# EAGLE design SingleLight (EAGLE 7.3.0)
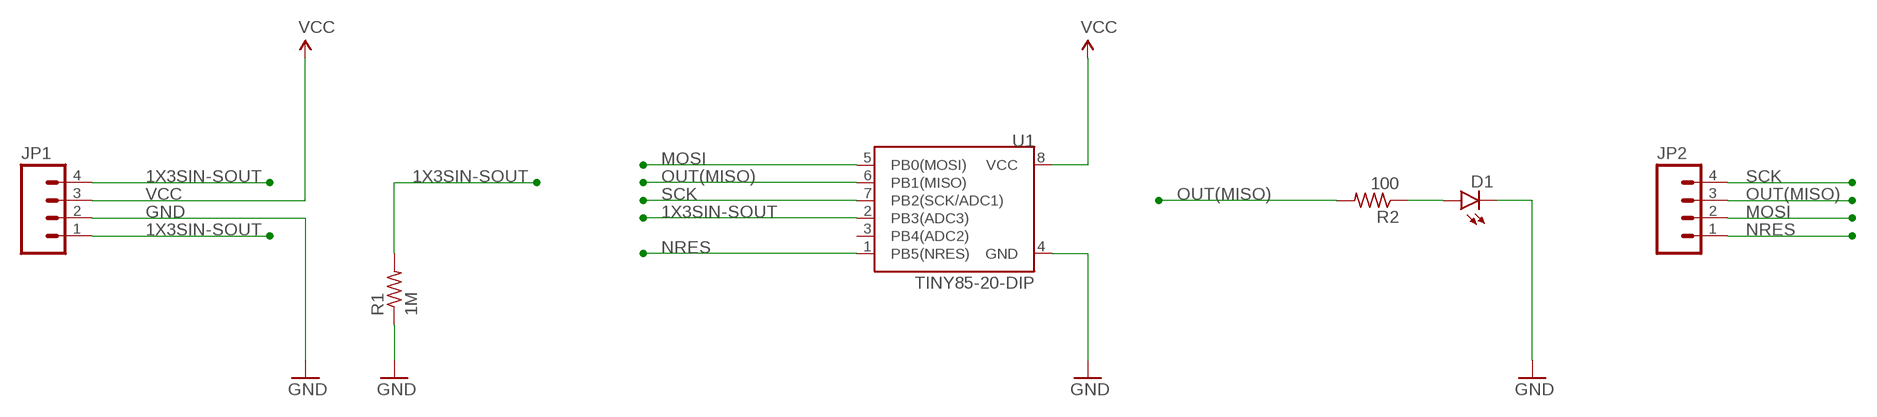
[diagram p0: schematic, sheet 1]

## Parts
D1  LED5MM  [LED5MM]
JP1  M04PTH  [1X04]
JP2  M04PTH  [1X04]
R1  1M  R-US_R0603  [R0603]
R2  100  R-US_R0603  [R0603]
U1  TINY85-20-DIP  ATTINY45TINY85-20-DIP  [DIP08]

## Nets
1X3SIN-SOUT: JP1.1 JP1.4 R1.2 U1.2(PB3(ADC3))
GND: D1.K(C) JP1.2 R1.1 U1.4(GND)
MOSI: JP2.2 U1.5(PB0(MOSI))
N$1: D1.A R2.1
NRES: JP2.1 U1.1(PB5(NRES))
OUT(MISO): JP2.3 R2.2 U1.6(PB1(MISO))
SCK: JP2.4 U1.7(PB2(SCK/ADC1))
VCC: JP1.3 U1.8(VCC)
Unconnected: U1.3(PB4(ADC2))

## Library data of the parts
D1 = SparkFun-LED:LED: LEDs Standard schematic elements and footprints for 5mm, 3mm, 1206, and 0603 sized LEDs. 5mm - Spark Fun Electronics SKU : COM-00529 (and others)
JP1 JP2 = SparkFun-Connectors:M04: Header 4 Standard 4-pin 0.1" header. Use with straight break away headers (SKU : PRT-00116), right angle break away headers (PRT-00553), swiss pins (PRT-00743), machine pins (PRT-00117), and female headers (PRT-00115). Molex polarized connector foot print use with SKU : PRT-08231 with associated crimp pins and housings. 1MM SMD Version SKU: PRT-10208
R1 R2 = adafruit:R-US_: RESISTOR, American symbol
U1 = SparkFun-DigitalIC:ATTINY45: Atmel 8-pin 2/4/8kB flash uC; PROD_ID: IC-09445

## Board
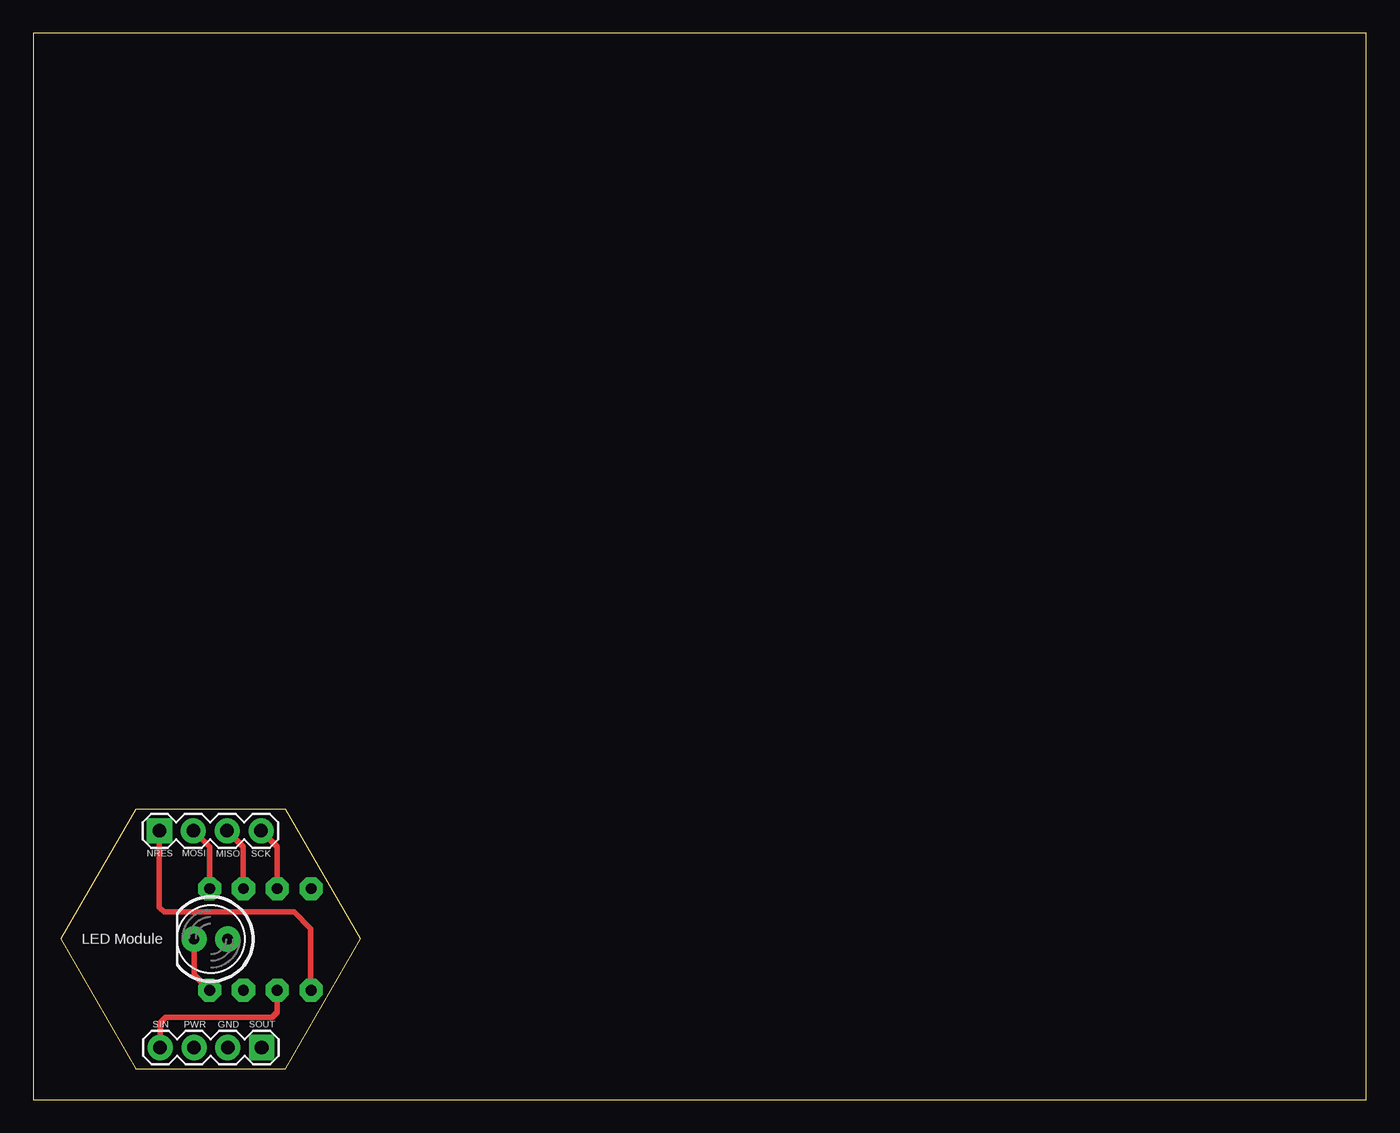
[diagram p1: board, top side]
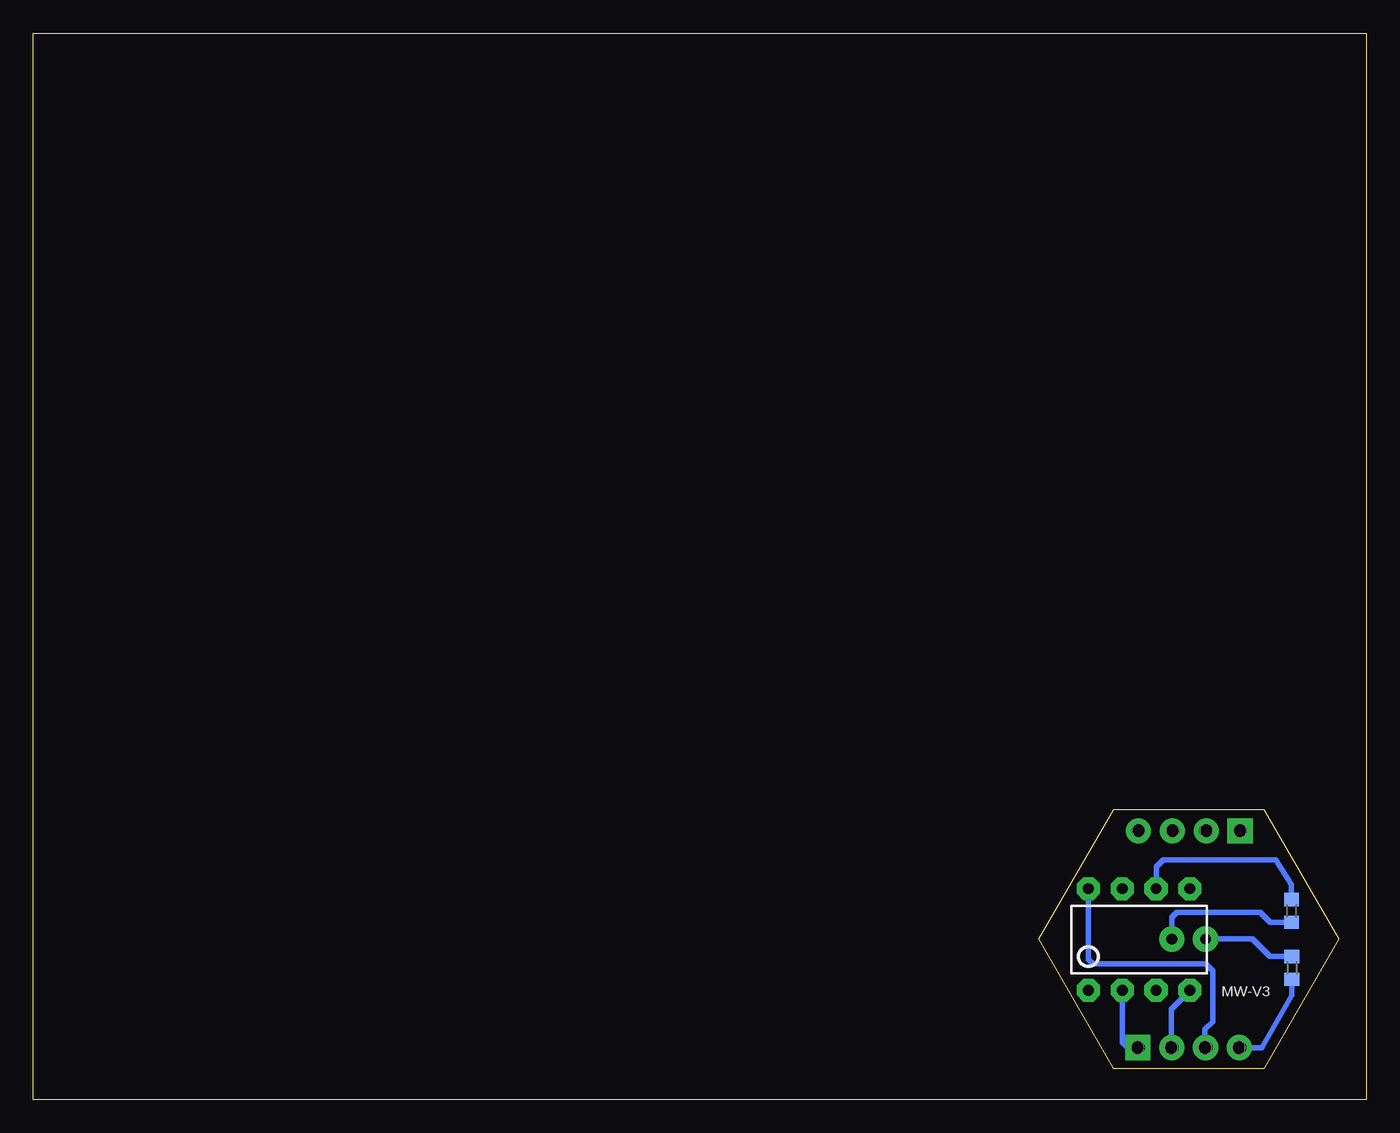
[diagram p2: board, bottom side, seen from below]

Size 100 x 80 mm. Coordinates in mm from the lower left corner, seen from the top.
Outline: 0,0 100,0 100,80 0,80 0,0
Outline: 7.69,2.3 18.94,2.3 24.56,12.04 18.94,21.78 7.69,21.78 2.06,12.04 7.69,2.3
Copper layers (1*16): Top 0.035mm / dielectric 1.5mm / Bottom 0.035mm
Design rules "default *": minimum track width 10mil, minimum drill 24mil, track to track 8mil, track to pad 8mil, pad to pad 8mil, via to via 8mil, smd to smd 8mil, copper to edge 0mil, drill to drill 8mil, minimum pad ring 10mil, minimum via ring 8mil, stop-mask expansion 4mil, vias tented up to drill 0mil, thermal gap 10mil

### Footprints (pad centres in the part's own frame; a part is rotated, then mirrored left to right if it is on the bottom)
LED5MM = drill 0.813 pad 1.88: A -1.27,0; K 1.27,0
1X04 = drill 1.016 pad 1.88 square: 1 0,0 | drill 1.016 pad 1.88: 2 2.54,0; 3 5.08,0; 4 7.62,0
R0603 = smd 1 x 1.1: 1 -0.85,0; 2 0.85,0
DIP08 = drill 0.813 pad 1.727 octagon: 1 -3.81,-3.81; 2 -1.27,-3.81; 3 1.27,-3.81; 4 3.81,-3.81; 5 3.81,3.81; 6 1.27,3.81; 7 -1.27,3.81; 8 -3.81,3.81

### Placement (x,y rotation side)
D1  13.32,12.04 180 top
JP1  17.13,3.9 180 top
JP2  9.46,20.17 0 top
R1  5.58,9.87 270 bottom
R2  5.59,14.15 90 bottom
U1  17.03,12.01 0 bottom

### Tracks (layer width: path | path; a pad name or v marks a point on that pad's centre or on a via)
1X3SIN-SOUT
  Top 0.4: 17.9,6.16 9.93,6.16
  Top 0.406: U1.2 18.3,6.56 17.9,6.16 | 9.93,6.16 9.52,5.75 JP1.4
  Bottom 0.4: U1.2 18.3,4.29
  Bottom 0.406: R1.2 5.58,7.84 7.84,3.89 JP1.4 | 18.3,4.29 17.88,3.87 17.16,3.87 JP1.1
GND
  Top 0.406: D1.K 12.05,9.37 U1.4
  Bottom 0.4: 13.22,8.17 14.62,6.77 14.62,3.93
  Bottom 0.406: D1.K 8.55,12.04 7.24,10.73 R1.1 | U1.4 13.22,8.17 | 14.62,3.93 JP1.2
MOSI
  Top 0.406: JP2.2 13.22,18.95 U1.5
N$1
  Bottom 0.406: D1.A 14.6,13.67 14.21,14.06 7.96,14.06 7.2,13.3 R2.1
NRES
  Top 0.4: 20.82,12.81 20.82,8.22
  Top 0.406: JP2.1 9.46,14.42 9.8,14.08 19.55,14.08 20.82,12.81 | 20.82,8.22 U1.1
OUT(MISO)
  Top 0.406: JP2.3 15.76,18.95 U1.6
  Bottom 0.4: 15.23,17.98 6.77,17.98
  Bottom 0.406: U1.6 15.76,17.45 15.23,17.98 | R2.2 5.61,16.15 6.77,17.98
SCK
  Top 0.406: JP2.4 18.3,18.95 U1.7
VCC
  Bottom 0.4: 20.51,10.19 12.04,10.19
  Bottom 0.406: U1.8 20.84,10.52 20.51,10.19 | 12.04,10.19 11.52,9.67 11.52,5.84 12.09,5.27 12.09,3.94 JP1.3

### Text on the board
tPlace: NRES | MOSI | MISO | SCK | LED Module | SIN | PWR | GND | SOUT
bPlace: MW-V3